# EAGLE design RightConnector (EAGLE 9.6.2)
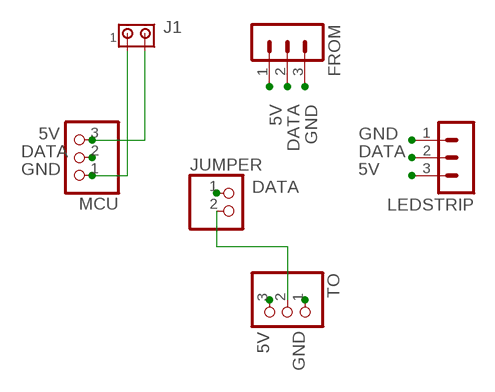
[diagram p0: schematic, sheet 1]

## Parts
FROM  MA03-1  [MA03-1]
J1  MTA02-156  [1X2MTA]
JUMPER  PINHD-1X2  [1X02]
LEDSTRIP  MA03-1  [MA03-1]
MCU  PINHD-1X3/90  [1X03/90]
TO  PINHD-1X3/90  [1X03/90]

## Nets
5V: FROM.1 J1.2 LEDSTRIP.3 MCU.3 TO.3
DATA: FROM.2 JUMPER.1 LEDSTRIP.2 MCU.2
GND: FROM.3 J1.1 LEDSTRIP.1 MCU.1 TO.1
N$1: JUMPER.2 TO.2

## Library data of the parts
FROM LEDSTRIP = con-lstb:MA03-1: PIN HEADER; OC_FARNELL: unknown; OC_NEWARK: unknown
J1 = con-amp:MTA02-156: AMP connector
JUMPER = pinhead:PINHD-1X2: PIN HEADER
MCU TO = pinhead:PINHD-1X3: PIN HEADER

## Board
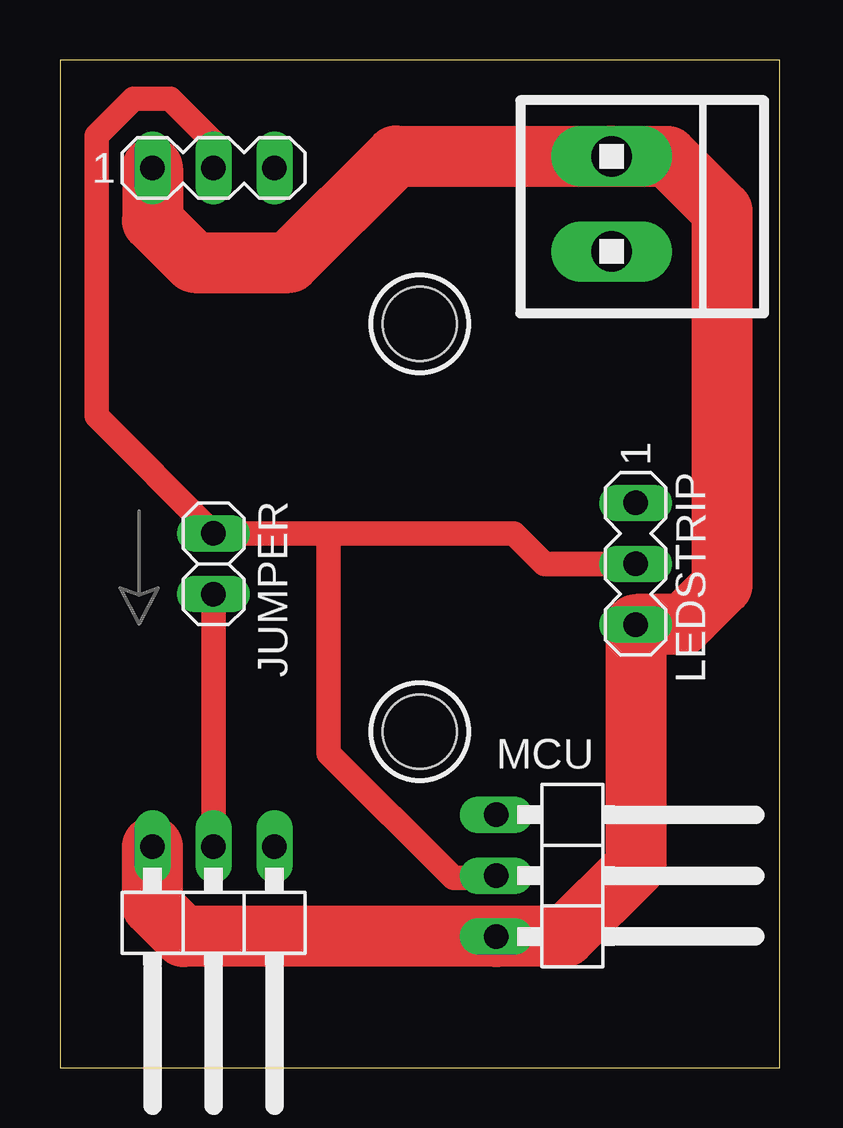
[diagram p1: board, top side]
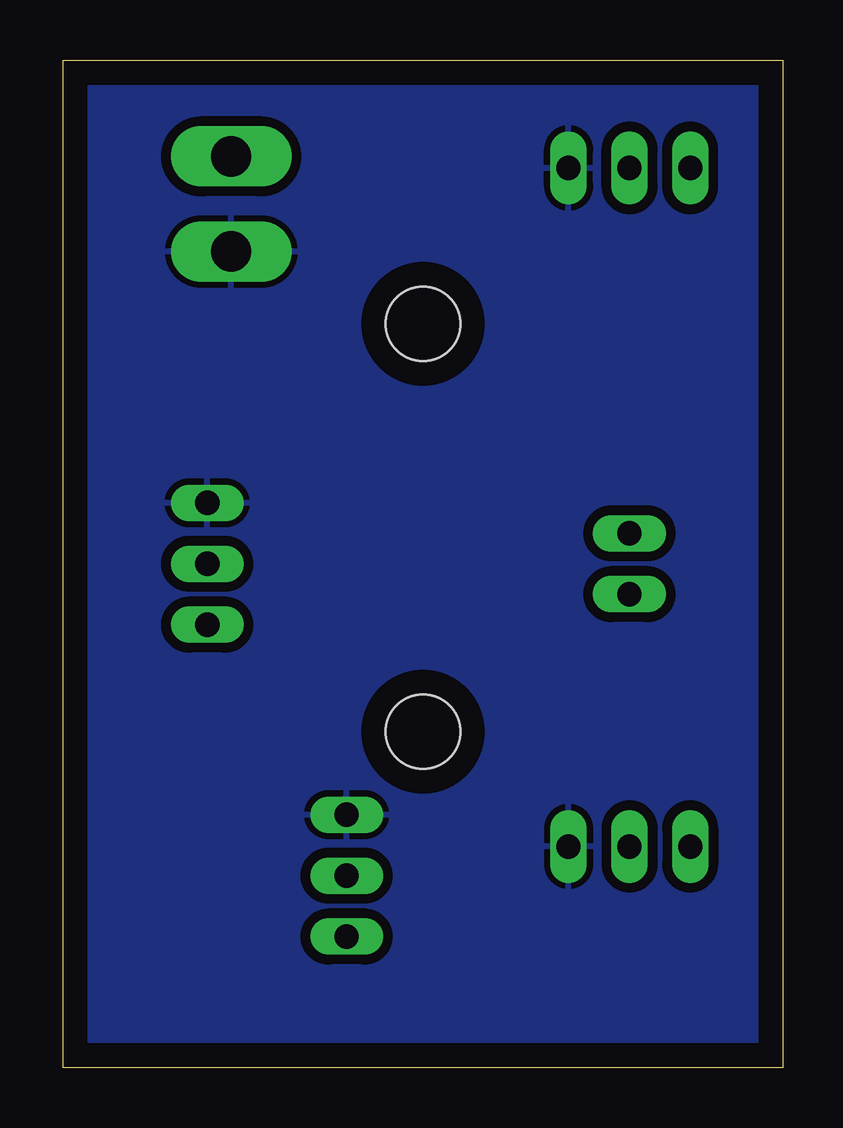
[diagram p2: board, bottom side, seen from below]

Size 30 x 42 mm. Coordinates in mm from the lower left corner, seen from the top.
Outline: 0,0 30,0 30,42 0,42 0,0
Copper layers (1*16): Top 0.035mm / dielectric 1.5mm / Bottom 0.035mm
Design rules "ACES_THT": minimum track width 18mil, minimum drill 0.35mm, track to track 10mil, track to pad 10mil, pad to pad 10mil, via to via 10mil, smd to smd 6mil, copper to edge 40mil, drill to drill 6mil, minimum pad ring 10mil, minimum via ring 8mil, stop-mask expansion 4mil, vias tented up to drill 0mil, thermal gap 10mil

### Footprints (pad centres in the part's own frame; a part is rotated, then mirrored left to right if it is on the bottom)
MA03-1 = drill 1.016 long: 1 -2.54,0; 2 0,0; 3 2.54,0
1X2MTA = drill 1.676 long: 1 1.981,0; 2 -1.981,0
1X02 = drill 1.016 long: 1 -1.27,0; 2 1.27,0
1X03/90 = drill 1.016 long: 1 -2.54,-3.81; 2 0,-3.81; 3 2.54,-3.81
MOUNTINGHOLE_3.2MM_PLATEDTHIN = hole 3.1: 0,0

### Placement (x,y rotation side)
FROM  6.4,37.5 0 top
J1  23,36 270 top
JUMPER  6.4,21 270 top
LEDSTRIP  24,21 270 top
MCU  22,8 270 top
TO  6.4,5.4 180 top
U$1  [MOUNTINGHOLE_3.2MM_PLATEDTHIN]  15,31 0 top
U$2  [MOUNTINGHOLE_3.2MM_PLATEDTHIN]  15,14 0 top

### Tracks (layer width: path | path; a pad name or v marks a point on that pad's centre or on a via)
5V
  Top 2.54: FROM.1 3.86,35.29 5.59,33.55 9.55,33.55 14,38 22.98,38 J1.2 25.33,37.98 27.6,35.71 27.6,20.1 25.96,18.46 LEDSTRIP.3 24,8.4 21.06,5.46 MCU.3 5.14,5.46 3.86,6.74 TO.3
DATA
  Top 1.016: FROM.2 6.4,38.58 4.59,40.38 3.07,40.38 1.52,38.84 1.52,27.15 JUMPER.1 11.2,22.27 | 11.2,22.27 18.93,22.27 20.2,21 LEDSTRIP.2 | 11.2,22.27 11.2,13.1 16.4,7.9 18.09,7.9 MCU.2
GND
  pour Bottom (isolate 0.406): 0,42 30,42 30,0 0,0
N$1
  Top 1.016: JUMPER.2 TO.2

### Text on the board
tDocu: 5V | GND | Right Connector | GND | Data | 5V | GND | Data | 5V
bDocu: Ping pong LED matrix v1.0 / Xander Chin